# Altium schematic sheet Fan_Timer.SchDoc
size A4; SheetNumber: 2; SheetTotal: 5
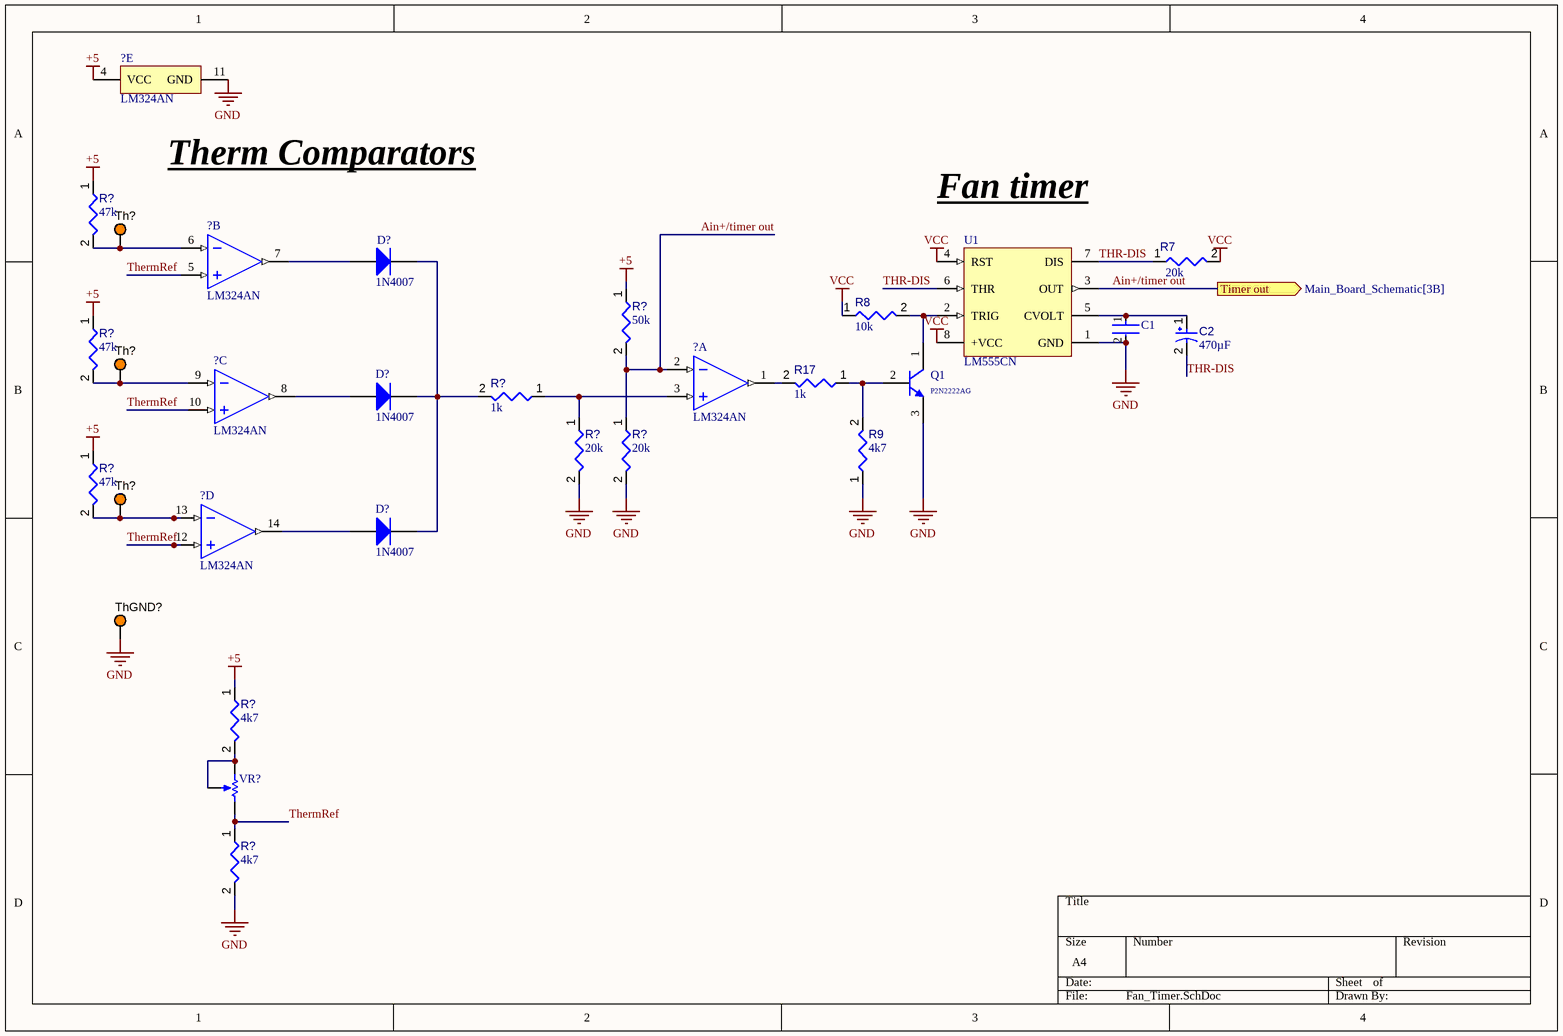
[diagram p0: Fan_Timer.SchDoc]

## Parts
(Parts that share a designator on the sheet are numbered #1, #2 ... from top to bottom, then left to right.)
?#1  LM324AN  [TI-N0014A]  (part E of 5)
?#2  LM324AN  [TI-N0014A]  (part B of 5)
?#3  LM324AN  [TI-N0014A]  (part A of 5)
?#4  LM324AN  [TI-N0014A]  (part C of 5)
?#5  LM324AN  [TI-N0014A]  (part D of 5)
C1  RCER71H103K0K1H03B  [FP-RCE0K1-MFG]  (value not drawn)
C2  value 470µF  [CAPPR65-350-1150X800X1250]  (hidden comment: ECA1HM101)
D?#1  1N4007  [FAIR-DO-41-2]
D?#2  1N4007  [FAIR-DO-41-2]
D?#3  1N4007  [FAIR-DO-41-2]
Q1  P2N2222AG  [ONSC-TO-92-3-29-11]
R7  value 20k  [RESA60-630X240]  (hidden comment: MFR-25FBF52-1K)
R8  value 10k  [RESA60-630X240]  (hidden comment: MFR-25FBF52-1K)
R9  value 4k7  [RESA60-630X240]  (hidden comment: MFR-25FBF52-100R)
R17  value 1k  [RESA60-630X240]  (hidden comment: MFR-25FBF52-100R)
R?#1  value 47k  [RESA60-630X240]  (hidden comment: MFR-25FBF52-100R)
R?#2  value 50k  [RESA60-630X240]  (hidden comment: MFR-25FBF52-100R)
R?#3  value 47k  [RESA60-630X240]  (hidden comment: MFR-25FBF52-100R)
R?#4  value 1k  [RESA60-630X240]  (hidden comment: MFR-25FBF52-100R)
R?#5  value 20k  [RESA60-630X240]  (hidden comment: MFR-25FBF52-100R)
R?#6  value 20k  [RESA60-630X240]  (hidden comment: MFR-25FBF52-100R)
R?#7  value 47k  [RESA60-630X240]  (hidden comment: MFR-25FBF52-100R)
R?#8  value 4k7  [RESA60-630X240]  (hidden comment: MFR-25FBF52-100R)
R?#9  value 4k7  [RESA60-630X240]  (hidden comment: MFR-25FBF52-100R)
Th?#1  5003  [KSTN-5003]  (value not drawn)
Th?#2  5003  [KSTN-5003]  (value not drawn)
Th?#3  5003  [KSTN-5003]  (value not drawn)
ThGND?  5003  [KSTN-5003]  (value not drawn)
U1  LM555CN  [N08E]
VR?  3362P-1-104LF  [BOUR-3362P]  (value not drawn)

## Ports
Timer out (out, see Main_Board_Schematic[3B])

## Nets
+5: ?#1.4(VCC) R?#1.1 R?#2.1 R?#3.1 R?#7.1 R?#8.1
GND: ?#1.11(GND) C1.2 Q1.3(E) R9.1 R?#5.2 R?#6.2 R?#9.2 ThGND?.1 U1.1(GND)
VCC: R7.2 R8.1 U1.4(RST) U1.8(+VCC)
Ain+/timer out: ?#3.2(1IN-) R?#2.2 R?#6.1 U1.3(OUT) ; port Timer out
ThermRef: ?#2.5(2IN+) ?#4.10(3IN+) ?#5.12(4IN+) R?#9.1 VR?.3(CW)
THR-DIS: C2.2 R7.1 U1.6(THR) U1.7(DIS)
Net?#2_6: ?#2.6(2IN-) R?#1.2 Th?#1.1
Net?#2_7: ?#2.7(2OUT) D?#1.2(A)
Net?#3_1: ?#3.1(1OUT) R17.2
Net?#3_3: ?#3.3(1IN+) R?#4.1 R?#5.1
Net?#4_8: ?#4.8(3OUT) D?#2.2(A)
Net?#4_9: ?#4.9(3IN-) R?#3.2 Th?#2.1
Net?#5_13: ?#5.13(4IN-) R?#7.2 Th?#3.1
Net?#5_14: ?#5.14(4OUT) D?#3.2(A)
NetC1_1: C1.1 C2.1 U1.5(CVOLT)
NetD?#1_1: D?#1.1(K) D?#2.1(K) D?#3.1(K) R?#4.2
NetQ1_1: Q1.1(C) R8.2 U1.2(TRIG)
NetQ1_2: Q1.2(B) R9.2 R17.1
NetR?#8_2: R?#8.2 VR?.1(CCW) VR?.2(S)

## Notes on the sheet
- Therm Comparators
- Fan timer

## Library data of the parts
?#1-?#5 = CMP-014-00016-2: Quadruple Operational Amplifier, 1.2 MHz, 0 to 70 degC, 14-Pin PDIP (N), Pb-Free (RoHS), Tube; Manufacturer: Texas Instruments (TI); Max Dual Supply Voltage: 16V; Nominal Dual Supply Voltage: 12V; Nominal Voltage Gain: 100dB; Min Supply Voltage: 1.5V; Unity Gain Bandwidth Product: 1.2MHz; Output Current: 30mA; Nominal Supply Current: 3mA; RoHS Compliant: True; Package Reference: N-14; Min Operating Temperature: 0°C; Case/Package: DIP; Mounting Technology: TH; Package Description: 14-Pin Double In-line Package, Body 19.305 x 6.35 mm, Pitch 2.54 mm; Nominal Supply Voltage: 12V; Package URL: http://www.ti.com/lit/ml/mpdi002c/mpdi002c.pdf; Package Quantity: 25; Datasheet Version: SLOS066W, 03/2015; Manufacturer URL: http://www.ti.com/; Datasheet URL: http://www.ti.com/lit/ds/symlink/lm324a.pdf; Min Dual Supply Voltage: 1.5V; Max Supply Voltage: 16V; Pins: 14; Max Operating Temperature: 70°C
C1 = CMP-06035-044411-1: Cap Ceramic 10nF 50V X7R ±10% Radial 5mm +125°C Automotive Bulk; Lead/Base Style: Formed Leads; Lead Diameter: 0.5mm; Resistor Type: Ceramic; Mount: Through Hole; Capacitance: 10nF; Lead Pitch: 0.197inch; Package Quantity: 500; Dielectric: X7R; Lead Free: Lead Free; Min Operating Temperature: -55°C; Packaging: Bulk; Width: 0.098inch; Length: 0.142inch; Voltage Rating: 50V; Case/Package: Radial; Max Operating Temperature: 125°C; Ratings: AEC-Q200; Height - Seated (Max): 0.138inch; Height: 3.5mm; Termination: Radial; Voltage Rating (DC): 50V; Tolerance: 10%
C2 = CMP-001-00026-7: Aluminum Electrolytic Capacitor, 100 uF, +/- 20%, 50 V, -40 to 85 degC, 2-Pin THD, RoHS, Bulk; Manufacturer: Panasonic; Voltage Rating: 50V; Ripple Current: 250mA; Datasheet URL: https://industrial.panasonic.com/cdbs/www-data/pdf/RDF0000/ABA0000C1218.pdf; Lead Pitch: 3.5mm; Mounting Technology: TH; Package Description: 2-Pin Radial Lead, Dia 8 mm, Height 12.5 mm; Diameter: 8mm; Ripple Current (AC): 250mA; Manufacturer URL: http://www.panasonic.com/; Capacitor Type: Electrolytic; Max Operating Temperature: 85°C; Pins: 2; Min Operating Temperature: -40°C; Tolerance: 20%; Case/Package: Radial; Packaging: Bulk; Package Quantity: 200; Package Reference: CAPPR65-350-1150X800X1250; RoHS Compliant: True; Datasheet Version: Rev. 05, 10/2016
D?#1-D?#3 = CMP-004-00007-2: General Purpose Rectifier, 1.1 V, 1.0 A, -55 to 175 degC, 2-Pin DO-41, RoHS, Tape and Reel; Manufacturer: Fairchild; Peak Reverse Current: 5uA; Max Surge Current: 30A; Elements: 1; Forward Voltage: 1.1V; Package Version: Rev. 2, 09/2008; Forward Current: 1A; Package Quantity: 5000; Packaging: TapeandReel; Package URL: http://www.fairchildsemi.com/dwg/DO/DO41A.pdf; Manufacturer URL: https://www.fairchildsemi.com/; Package Reference: DO-41-2; Pins: 2; Min Operating Temperature: -55°C; Datasheet Version: Rev. 1.1.0, 11/2014; Max Operating Temperature: 175°C; RoHS Compliant: True; Case/Package: DO-41-2; Mounting Technology: TH; Package Description: 2-Pin Axial Lead, Dia 2.375 mm, Body Length 4.63 mm; Datasheet URL: https://www.fairchildsemi.com/datasheets/1N/1N4007.pdf
Q1 = CMP-1048-01402-1: Amplifier Transistor, NPN Silicon, 3-Pin TO-92, Pb-Free, Bulk Box; Manufacturer: On Semiconductor; IC Continuous (A): 0.6; fT Min (MHz): 300; ComponentLink2Description: Datasheet; ComponentLink1Description: Manufacturer URL; ComponentLink2URL: http://www.onsemi.com/pub_link/Collateral/P2N2222A-D.PDF; ComponentLink3Description: Package Specification; RoHS: TRUE; ComponentLink1URL: http://www.onsemi.com/; PartNumber: P2N2222AG; Mounting Technology: Through Hole; PackageReference: TO-92-3-29-11_AM_SL; Polarity: NPN; Packing: Bulk Box; DatasheetVersion: Rev. 7; PackageDescription: 3-Pin Transistor Outline, Body 4.825 x 3.685 mm, Pitch 1.27 mm; PackageVersion: Rev. AM; ComponentLink3URL: http://www.onsemi.cn/pub_link/Collateral/2N6426-D.PDF
R7 R8 = CMP-009-00048-4: Axial Resistor, 1 KOhm, +/- 1%, 250 mW, -55 to 155 degC, 2-Pin THD, RoHS, Bulk; Manufacturer: Yageo; Voltage Rating: 250V; Power: 250mW; Min Operating Temperature: -55°C; Max Operating Temperature: 155°C; Tolerance: 1%; Package Reference: MFR-25; Composition: CarbonFilm; Mounting Technology: TH; Packaging: Bulk; Case/Package: Axial; Datasheet URL: http://www.yageo.com/documents/recent/Yageo%20LR_MFR_2013.pdf; Package Quantity: 200; Manufacturer URL: http://www.yageo.com/; Package Description: 2-Pin Axial Lead, Dia 2.4 mm, Body Length 6.3 mm; Datasheet Version: Apr-13; RoHS Compliant: True
R9 R17 R?#1-R?#9 = CMP-009-00046-4: Axial Resistor, 100 Ohm, +/- 1%, 0.25 W, -55 to 155 degC, 2-Pin THD, RoHS, Bulk; Manufacturer: Yageo; Voltage Rating: 250V; Power: 250mW; Packaging: Bulk; Max Operating Temperature: 155°C; Mounting Technology: TH; Datasheet Version: Apr-13; Case/Package: Axial; RoHS Compliant: True; Package Description: 2-Pin Axial Lead, Dia 2.4 mm, Body Length 6.3 mm; Package Quantity: 200; Package Reference: MFR-25; Tolerance: 1%; Composition: CarbonFilm; Datasheet URL: http://www.yageo.com/documents/recent/Yageo%20LR_MFR_2013.pdf; Manufacturer URL: http://www.yageo.com/; Min Operating Temperature: -55°C
Th?#1-Th?#3 ThGND? = CMP-002-00037-2: Test Point, Orange, Height 4.6 mm, Tail Length 3 mm, 1-Pin THD, RoHS; Manufacturer: Keystone; Colour: Orange; Packaging: Bulk; Package Description: 1-Pin Through Hole Device, Dia 2.54 mm; Pins: 1; Package Reference: 5003; Datasheet Version: Jun-15; Case/Package: 5003; Mounting Technology: TH; Connector Type: TestPoint; Diameter: 2.54mm; Contact Material: Bronze; Datasheet URL: http://keyelco.com/userAssets/file/M65p56.pdf; Manufacturer URL: http://www.keyelco.com/; Package Quantity: 10; Contact Plating: Tin; RoHS Compliant: True
U1 = CMP-0056-00017-2: Timer, 8-pin MDIP; Manufacturer: National Semiconductor; CompType: Analog IC; PackageTopMarking: NSUZXYTTE#*LM*555CN; PowerWise: N; PackageReference: N08E; ComponentLink1Description: LM555 Datasheet; ComponentLink3URL: http://www.national.com/packaging/folders/n08e.html; ComponentLink1URL: http://www.national.com/ds/LM/LM555.pdf; ComponentLink2URL: http://www.national.com/pf/LM/LM555.html; PackageDescription: MDIP, .365 x .250 x .130in, 8 Lead, .100in Pitch; DatasheetVersion: Jul-2006; RevisionNote: Component URLs added; Code_JEDEC: MS-001-BA; PinCount: 8; ComponentLink3Description: N08E Package Page; PackageVersion: revG, May-2006; ComponentLink2Description: LM555 Web Page; RoHS: N
VR? = CMP-009-00040-2: Square Trimpot(R) Trimming Potentiometer, 100 KOhm, 300 V, -55 to 125 degC, 3-Pin THD, RoHS, Tube; Manufacturer: Bourns; Voltage Rating: 300V; Resistance: 100k; Power: 500mW; Tolerance: 10%; RoHS Compliant: True; Mounting Technology: TH; Datasheet URL: http://www.bourns.com/docs/Product-Datasheets/3362.pdf; Min Operating Temperature: -55°C; Composition: Potentiometer; Package Quantity: 250; Lead Pitch: 2.54mm; Case/Package: 3326P; Package Description: 3-Pin Through Hole Device, Body 6.6 x 6.99 mm, Pitch 2.54 mm; Datasheet Version: May-16; Packaging: Rail/Tube; Package Reference: 3326P; Manufacturer URL: http://www.bourns.com/; Max Operating Temperature: 125°C